# EasyEDA schematic Ohm_Sensor.json
TITLE: Ohmic probe sensor for HF starter plasma cutters; REV: 1.0; Date: 2025-03-04; Sheet: 1/1; Drawn By: Mehmet Ibrahim; Company: Mehmet Ibrahim
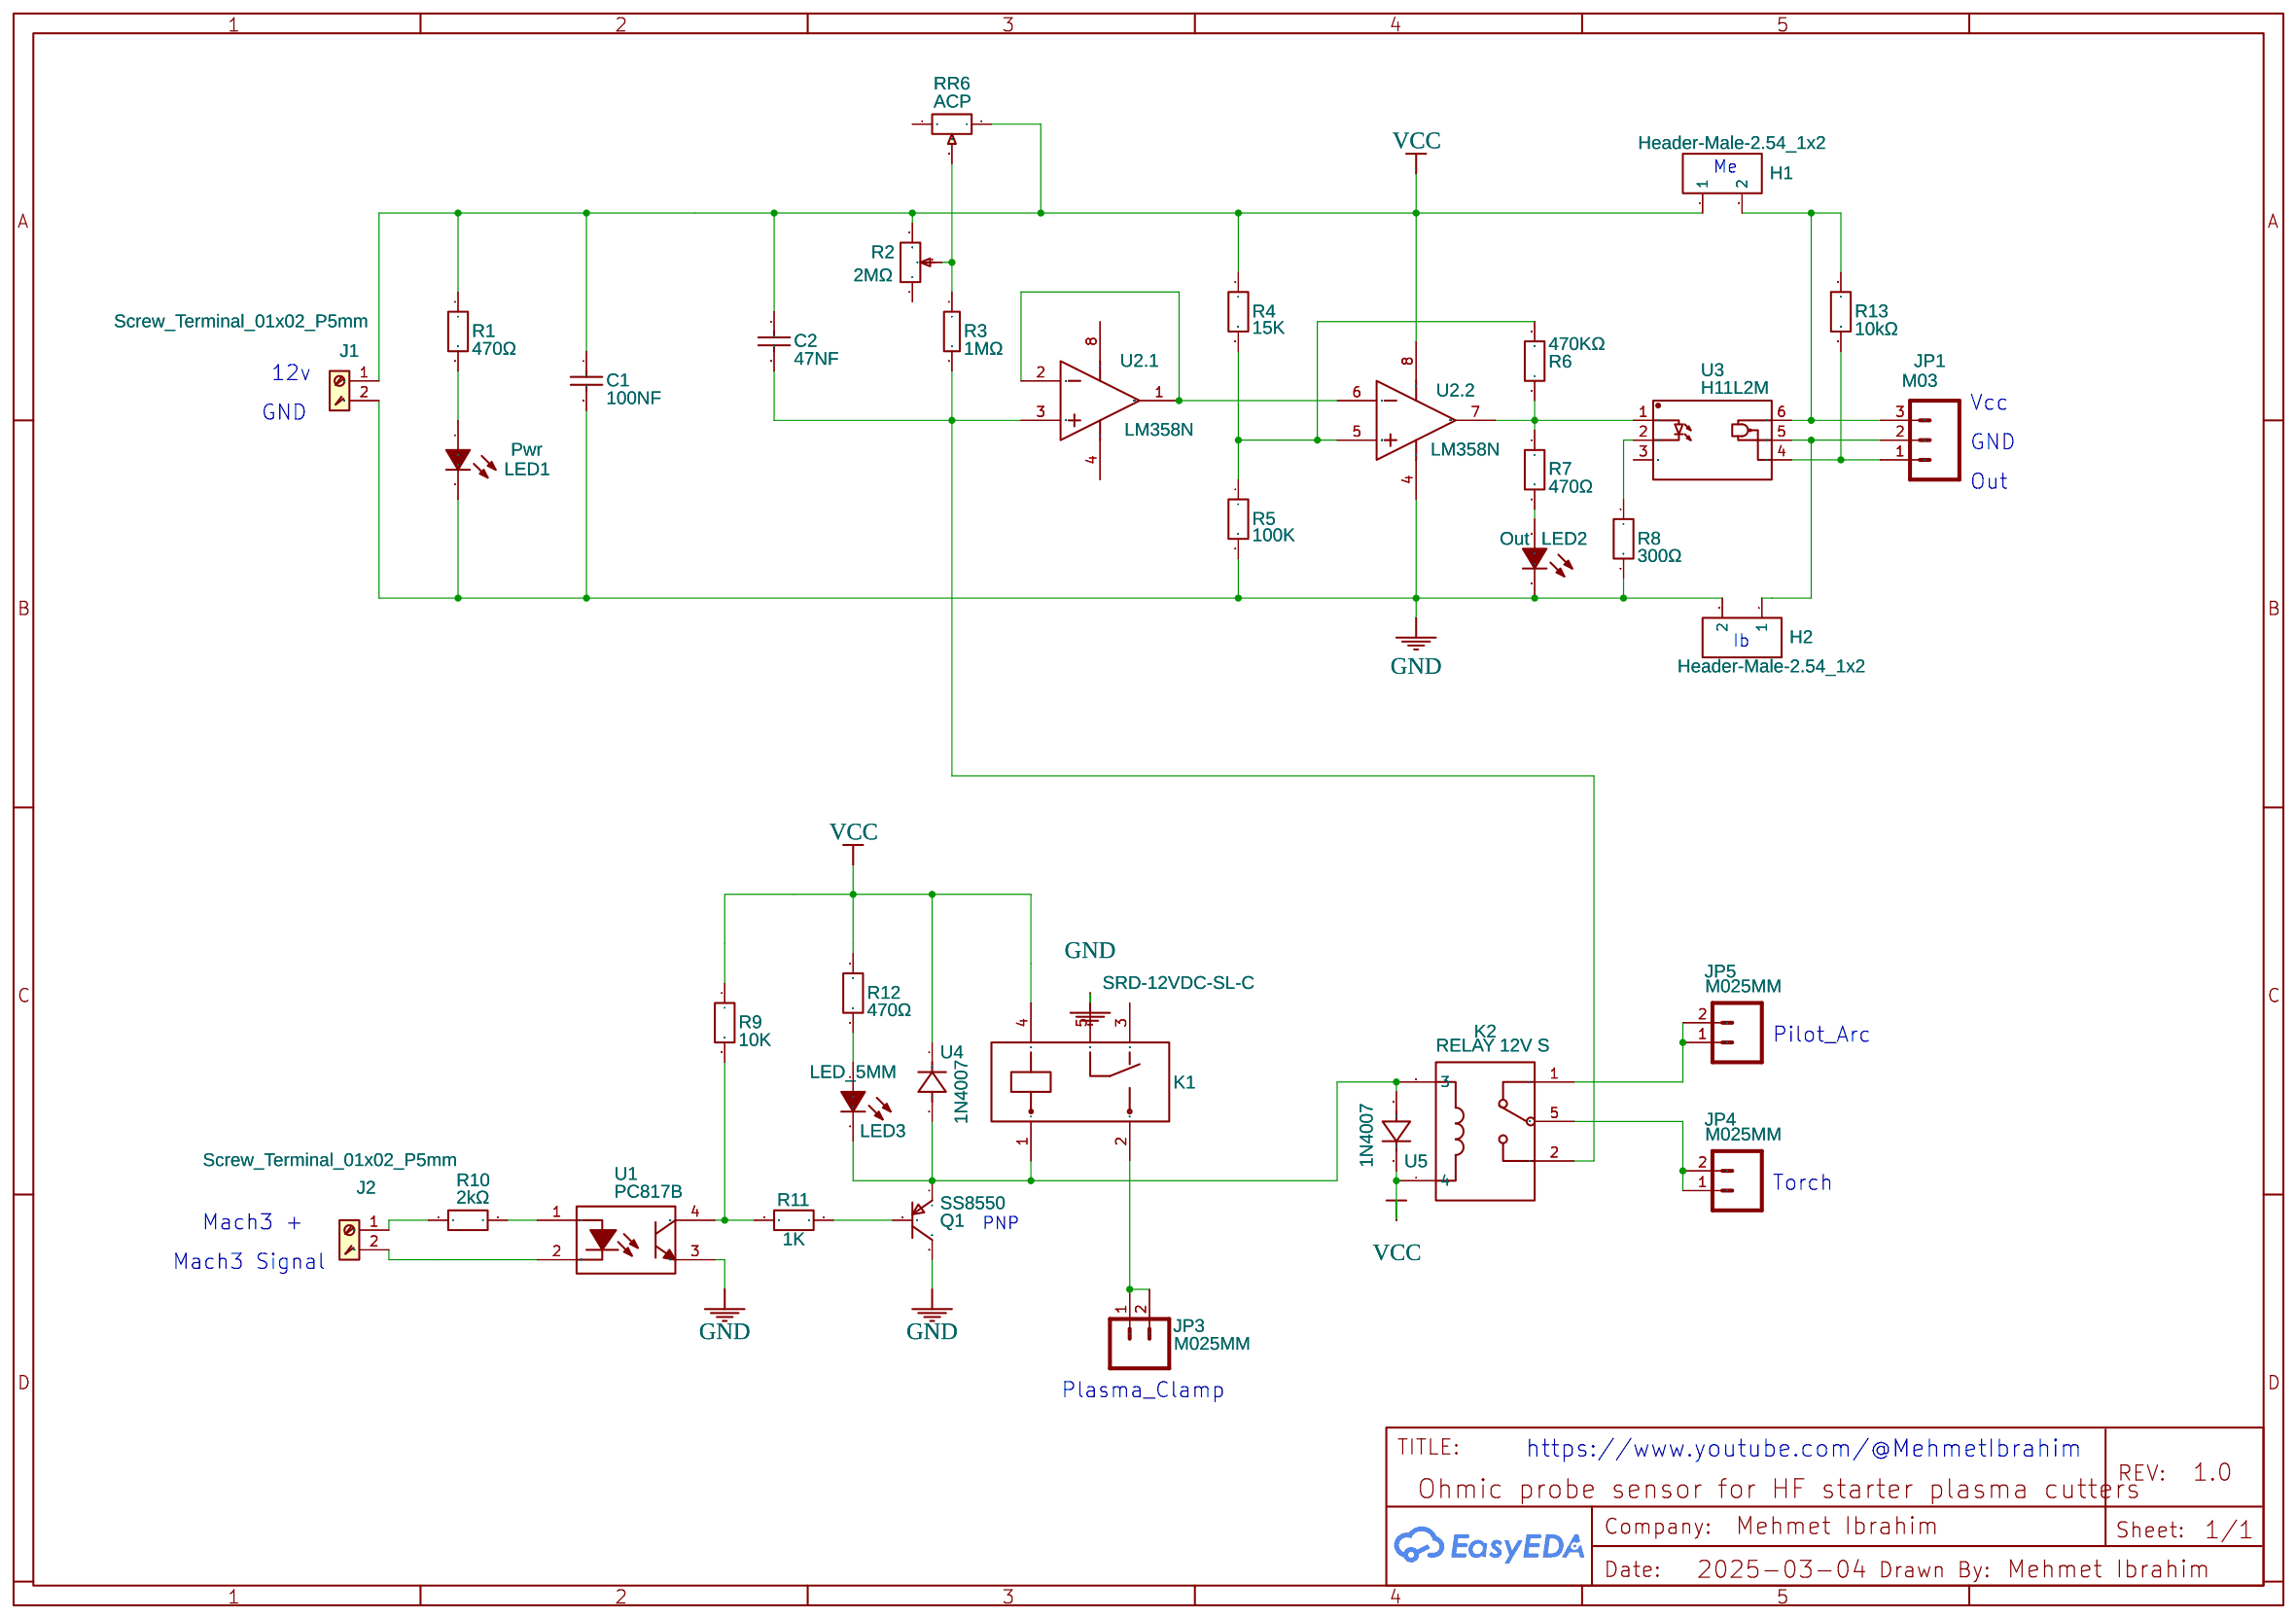
[diagram p0: schematic sheet]

## Parts
C1  100NF  [CERAMIC CAPACITOR 100NF]
C2  47NF  [CERAMIC CAPACITOR 100NF]
H1  Header-Male-2.54_1x2  [HDR-TH_2P-P2.54-V-M-1]
H2  Header-Male-2.54_1x2  [HDR-TH_2P-P2.54-V-M-1]
J1  Screw_Terminal_01x02_P5mm  [TERMINALBLOCK_ONSHORE_1X02_P5.00MM_HORIZONTAL]
J2  Screw_Terminal_01x02_P5mm  [TERMINALBLOCK_ONSHORE_1X02_P5.00MM_HORIZONTAL]
JP1  M03  [SCREWTERMINAL-5MM-3]
JP3  M025MM  [SCREWTERMINAL-5MM-2]
JP4  M025MM  [SCREWTERMINAL-5MM-2]
JP5  M025MM  [SCREWTERMINAL-5MM-2]
K1  SRD-12VDC-SL-C  [RELAY-TH_SRD-XXVDC-XL-C]
K2  RELAY 12V S  [RELAY-TH_SLA-12VDC-SL-C]
LED1  Pwr  [LED-TH_BD5.0-P2.54-FD_C9900023552]
LED2  Out  [LED-TH_BD5.0-P2.54-FD_C9900023552]
LED3  LED_5MM  [LED-TH_BD5.0-P2.54-FD_C9900023552]
Q1  SS8550  [TO-92-3_L4.8-W3.7-P2.54-L]
R1  470Ω  [RES-TH_BD2.4-L6.3-P10.30-D0.6]
R2  2MΩ  [RES-ADJ-TH_3362P]
R3  1MΩ  [RES-TH_BD2.2-L6.5-P10.50-D0.6]
R4  15K  [RES-TH_BD2.4-L6.3-P10.30-D0.6]
R5  100K  [RES-TH_BD2.4-L6.3-P10.30-D0.6]
R6  470KΩ  [RES-TH_BD2.4-L6.3-P10.30-D0.6]
R7  470Ω  [RES-TH_BD2.4-L6.3-P10.30-D0.6]
R8  300Ω  [RES-TH_BD2.4-L6.3-P10.30-D0.6]
R9  10K  [RES-TH_BD2.4-L6.3-P10.30-D0.6]
R10  2kΩ  [RES-TH_BD2.4-L6.3-P10.30-D0.6]
R11  1K  [RES-TH_BD2.4-L6.3-P10.30-D0.6]
R12  470Ω  [RES-TH_BD2.4-L6.3-P10.30-D0.6]
R13  10kΩ  [RES-TH_BD2.7-L6.2-P10.20-D0.4]
RR6  ACP  [ACP SPAIN]
U1  PC817B  [DIP-4_L4.6-W6.5-P2.54-LS7.6-BL]
U2  LM358N  [PDIP-8_L10.2-W5.9-P2.54-LS7.6-BL]  (sections 1,2)
U3  H11L2M  [DIP-6_L8.5-W6.4-P2.54-LS7.6-BL]
U4  1N4007  [DO-41_BD2.4-L4.7-P8.70-D0.6-RD]
U5  1N4007  [DO-41_BD2.4-L4.7-P8.70-D0.6-RD]

## Library data of the parts
C1 C2 = CERAMIC CAPACITOR 100NF: Supplier Part: undefined; Supplier: LCSC; Manufacturer: LCSC; Manufacturer Part: CT4-0805Y104M500; Contributor: firstking
H1 H2 = Header-Male-2.54_1x2: Supplier: LCSC; Manufacturer: TE Connectivity(泰科电子); Manufacturer Part: 826629-2; Supplier Part: C86471; JLCPCB Part Class: Extended Part
J1 J2 = Screw_Terminal_01x02_P5mm: Contributor: ZelTroN-2K3 TRUST
JP1 = M03: Contributor: SparkFun
JP3-JP5 = M025MM: Standard 2-pin 0.1 header. Use with; Contributor: SparkFun
K1 = SRD-12VDC-SL-C: Supplier: LCSC; Manufacturer: 松乐; Supplier Part: C30431; JLCPCB Part Class: Extended Part
K2 = RELAY 12V S: Supplier: LCSC; Manufacturer: SONGLE; Manufacturer Part: SLA-12VDC-SL-C; Contributor: LCSC; Supplier Part: C125736; JLCPCB Part Class: Extended Part
LED1-LED3 = LED_5MM: Contributor: lcsc; Supplier: LCSC; Supplier Part: C9900023552; Manufacturer: null; JLCPCB Part Class: Extended Part
Q1 = SS8550CTA: Contributor: LCSC; Supplier: LCSC; Supplier Part: C327518; Manufacturer: onsemi(安森美); JLCPCB Part Class: Extended Part
R1 R4-R9 R11 R12 = RN 1/4W 300R F T/B A1: Contributor: LCSC; Supplier: LCSC; Supplier Part: C410638; Manufacturer: Tyohm(幸亚电阻); JLCPCB Part Class: Extended Part
R2 = 3362P-1-205LF: Resistance(Ohms): 2M; Supplier: LCSC; Manufacturer: BOURNS; Supplier Part: C124582; JLCPCB Part Class: Extended Part
R3 = CFR0W4J0105A50: Supplier: LCSC; Manufacturer: UNI-ROYAL(厚声); Supplier Part: C61306; JLCPCB Part Class: Extended Part
R10 = MFR-25FRE52-2K: Contributor: lcsc; Supplier: LCSC; Supplier Part: C1745563; Manufacturer: YAGEO(国巨); JLCPCB Part Class: Extended Part
R13 = CR1/4W-10K±5%-ST52: Contributor: lcsc; Supplier: LCSC; Supplier Part: C2894649; Manufacturer: VO(翔胜); JLCPCB Part Class: Extended Part
RR6 = ACP: Contributor: gokulpriya
U1 = PC817B: Contributor: LCSC; Supplier: LCSC; Supplier Part: C115499; Manufacturer: 华润华晶; JLCPCB Part Class: Extended Part
U2 = LM358N: subpart_no: 1; Supplier: LCSC; Supplier Part: C83405; Manufacturer: TI(德州仪器); Manufacturer Part: LM358N/NOPB; JLCPCB Part Class: Extended Part
U3 = H11L2M: Contributor: LCSC; Supplier: LCSC; Supplier Part: C258255; Manufacturer: onsemi(安森美); JLCPCB Part Class: Extended Part
U4 U5 = 1N4007_C5261026: Supplier: LCSC; Supplier Part: C5261026; Manufacturer: CJ(江苏长电/长晶); Contributor: lcsc; JLCPCB Part Class: Extended Part

## Nets
GND: C1.2 H2.2 J1.2(Pin) K1.5 LED1.2(K) LED2.2(K) Q1.3(C) R5.2 R8.2 U1.3(EM) U2.4(-V)
VCC: C1.1 C2.1 H1.1 J1.1(Pin) K1.4 K2.4 R1.1 R2.3 R4.1 R9.1 R12.1 RR6.2(1) U2.8(+V) U4.1(C) U5.1(C)
Net-(C2-2): C2.2 K2.2 R3.2 U2.3(+IN 1)
Net-(H1-2): H1.2 JP1.3 R13.1 U3.6(VCC)
Net-(H2-1): H2.1 JP1.2 U3.5(GND)
Net-(J2-1): J2.1(Pin) R10.1
Net-(J2-2): J2.2(Pin) U1.2(CAT)
Net-(JP1-1): JP1.1 R13.2 U3.4(VO)
Net-(JP3-1): JP3.1 JP3.2 K1.2
Net-(JP4-1): JP4.1 JP4.2 K2.5
Net-(JP5-1): JP5.1 JP5.2 K2.1
Net-(K1-1): K1.1 K2.3 LED3.2(K) Q1.1(E) U4.2(A) U5.2(A)
Net-(LED1-1): LED1.1(A) R1.2
Net-(LED2-1): LED2.1(A) R7.2
Net-(LED3-1): LED3.1(A) R12.2
Net-(Q1-2): Q1.2(B) R11.2
Net-(R2-2): R2.2 R3.1 RR6.3(2)
Net-(R4-2): R4.2 R5.1 R6.2 U2.5(+IN 2)
Net-(R6-1): R6.1 R7.1 U2.7(OUT 2) U3.1(A)
Net-(R8-1): R8.1 U3.2(C)
Net-(R9-2): R9.2 R11.1 U1.4(COL)
Net-(R10-2): R10.2 U1.1(AN)
Net-(U2.1-1): U2.1(OUT 1) U2.2(-IN 1) U2.6(-IN 2)

Not connected (* = marked no-connect by the designer): K1 3; R2 1; RR6 1(3); U3 3(NC)

## Notes on the sheet
- Me
- 12v
- Vcc
- GND
- GND
- Out
- Ib
- Pilot_Arc
- Torch
- Mach3 +
- PNP
- Mach3 Signal
- Plasma_Clamp
- https://www.youtube.com/@MehmetIbrahim
